# Altium schematic sheet mcu_core.SchDoc
size A4
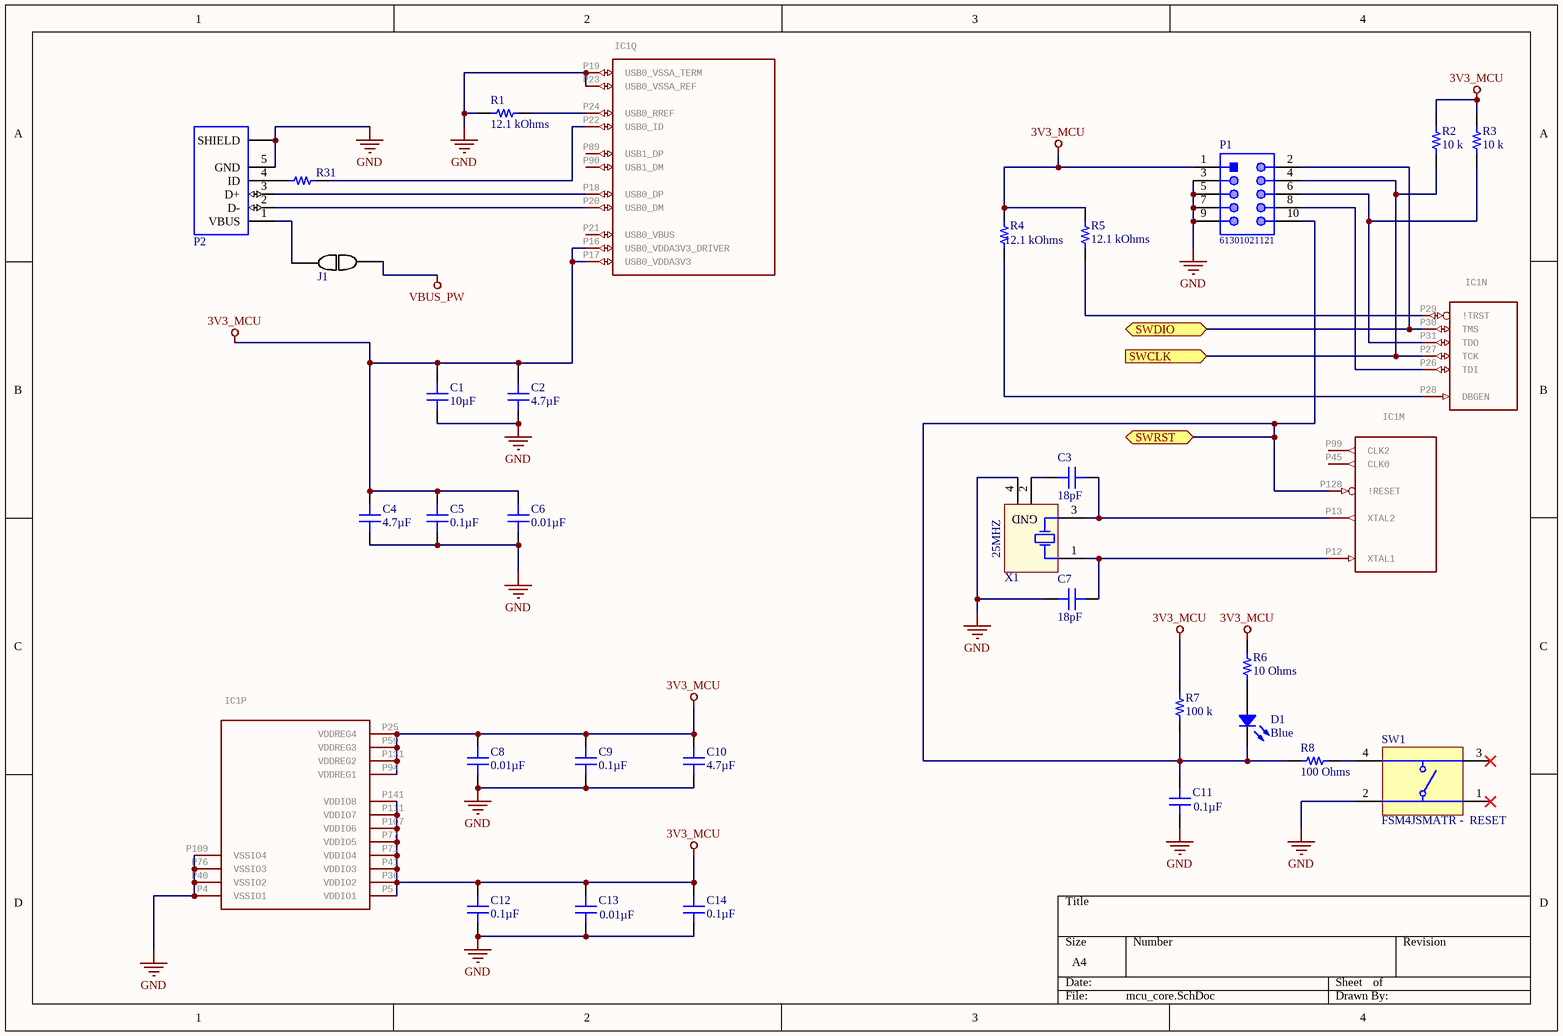
[diagram p0: mcu_core.SchDoc]

## Parts
C1  10µF  [CAP 0603_1608]
C2  4.7µF  [CAP 0603_1608]
C3  18pF  [CAP 0603_1608]
C4  4.7µF  [CAP 0603_1608]
C5  0.1µF  [CAP 0603_1608]
C6  0.01µF  [CAP 0603_1608]
C7  18pF  [CAP 0603_1608]
C8  0.01µF  [CAP 0603_1608]
C9  0.1µF  [CAP 0603_1608]
C10  4.7µF  [CAP 0603_1608]
C11  0.1µF  [CAP 0603_1608]
C12  0.1µF  [CAP 0603_1608]
C13  0.01µF  [CAP 0603_1608]
C14  0.1µF  [CAP 0603_1608]
D1  Blue  [LED 0603_1608 BLUE]
IC1  LQFP144 - SOT486-1    LQFP144: plastic low profile quad flat package; 144 leads; body 20 x 20 x 1.4 mm    body + leads 22 x 22 mm   Solderland (pads) 0.4 x 1.5 mm on corners (8 x) and 0.28 x 1.5 mm (136 x)  [LQFP144]  (value not drawn)  (parts M,N,P,Q of 17)
J1  103185-2  [TE_103185-2]  (value not drawn)
P1  61301021121  [61301021121]
P2  47346-0001  [MOLEX_47346-0001]  (value not drawn)
R1  12.1 kOhms  [RES 0603_1608]
R2  10 k  [RES 0603_1608]
R3  10 k  [RES 0603_1608]
R4  12.1 kOhms  [RES 0603_1608]
R5  12.1 kOhms  [RES 0603_1608]
R6  10 Ohms  [RES 0603_1608]
R7  100 k  [RES 0603_1608]
R8  100 Ohms  [RES 0603_1608]
R31  (no value)  [RES 0603_1608]
SW1  FSM4JSMATR -  RESET  [TECO-FSM4JSMATR_V]
X1  25MHZ  [ABRA-ABMM2-4_V]

## Ports
SWCLK (in), SWDIO (bidir), SWRST (bidir)

## Nets
3V3_MCU: C1.2 C2.2 C4.2 C5.2 C6.2 C8.2 C9.2 C10.2 C12.2 C13.2 C14.2 IC1.P5(VDDIO1) IC1.P16(USB0_VDDA3V3_DRIVER) IC1.P17(USB0_VDDA3V3) IC1.P25(VDDREG4) IC1.P36(VDDIO2) IC1.P41(VDDIO3) IC1.P59(VDDREG3) IC1.P71(VDDIO4) IC1.P77(VDDIO5) IC1.P94(VDDREG1) IC1.P107(VDDIO6) IC1.P111(VDDIO7) IC1.P131(VDDREG2) IC1.P141(VDDIO8) P1.1 R2.2 R3.2 R4.2 R5.2 R6.2 R7.1
GND: C1.1 C2.1 C4.1 C5.1 C6.1 C7.1 C8.1 C9.1 C10.1 C11.2 C12.1 C13.1 C14.1 IC1.P4(VSSIO1) IC1.P19(USB0_VSSA_TERM) IC1.P23(USB0_VSSA_REF) IC1.P40(VSSIO2) IC1.P76(VSSIO3) IC1.P109(VSSIO4) P1.3 P1.5 P1.7 P1.9 P2.5(GND) P2.SH1(SHIELD) P2.SH2(SHIELD) P2.SH3(SHIELD) P2.SH4(SHIELD) P2.SH5(SHIELD) P2.SH6(SHIELD) R1.2 SW1.2 X1.4(GND)
VBUS_PW: J1.1
SWCLK: IC1.P27(TCK) P1.4 R2.1 ; port SWCLK
SWDIO: IC1.P30(TMS) P1.2 ; port SWDIO
SWRST: C11.1 D1.2 IC1.P128(!RESET) P1.10 R7.2 R8.2 ; port SWRST
NetC3_1: C3.1 X1.2(GND)
NetC3_2: C3.2 IC1.P13(XTAL2) X1.3(X2)
NetC7_2: C7.2 IC1.P12(XTAL1) X1.1(X1)
NetD1_1: D1.1 R6.1
NetIC1_P18: IC1.P18(USB0_DP) P2.3(D+)
NetIC1_P20: IC1.P20(USB0_DM) P2.2(D-)
NetIC1_P22: IC1.P22(USB0_ID) R31.2
NetIC1_P24: IC1.P24(USB0_RREF) R1.1
NetIC1_P26: IC1.P26(TDI) P1.8
NetIC1_P28: IC1.P28(DBGEN) R4.1
NetIC1_P29: IC1.P29(!TRST) R5.1
NetIC1_P31: IC1.P31(TDO) P1.6 R3.1
NetJ1_2: J1.2 P2.1(VBUS)
NetP2_4: P2.4(ID) R31.1
NetR8_1: R8.1 SW1.4

Not connected (* = marked no-connect by the designer): IC1 P21(USB0_VBUS) P45(CLK0) P89(USB1_DP) P90(USB1_DM) P99(CLK2); SW1 1* 3*

## Library data of the parts
C1 = GRM188R61A106MAALD: CAP CER 10UF 10V X5R 0603; Manufacturer: Murata Electronics; Tolerance: ±20%; Part Number: GRM188R61A106MAALD; Value: 10µF; Applications: General Purpose; Capacitance: 10µF; ComponentLink1Description: Datasheet; ComponentLink1URL: https://search.murata.co.jp/Ceramy/image/img/A01X/G101/ENG/GRM188R61A106MAAL-01.pdf; ComponentLink2Description: DigiKey Link; ComponentLink2URL: http://digikey.com/product-detail/en/murata-electronics/GRM188R61A106MAALD/490-12734-1-ND/5797703; Device Package: 0603 (1608 Metric); LastUpdated: 02.09.2020 1:03:35; Lifecycle Status: Active; Minimum Order: 1; Mounting Type: Surface Mount, MLCC; Operating Temperature: -55°C ~ 85°C; Package / Case: 0603 (1608 Metric); Packaging: TapeAndReel; PartId: 2423; Part Status: Active; Price: 0.08; Series: GRM; Size / Dimension: 0.063" L x 0.031" W (1.60mm x 0.80mm); Supplier 1: DigiKey; Supplier Part Number 1: 490-12734-1-ND; Temperature Coefficient: X5R; Thickness (Max): 0.037" (0.95mm); Voltage - Rated: 10V
C2 C4 C10 = LMK107BJ475KA-T: CAP CER 4.7UF 10V X5R 0603; Manufacturer: Taiyo Yuden; Tolerance: ±10%; Part Number: LMK107BJ475KA-T; Value: 4.7µF; Applications: General Purpose; Capacitance: 4.7µF; ComponentLink1Description: Datasheet; ComponentLink1URL: https://ds.yuden.co.jp/TYCOMPAS/ut/detail?pn=LMK107BJ475KA-T  &u=M; ComponentLink2Description: DigiKey Link; ComponentLink2URL: http://digikey.com/product-detail/en/taiyo-yuden/LMK107BJ475KA-T/587-1441-1-ND/1004072; Device Package: 0603 (1608 Metric); LastUpdated: 02.09.2020 1:03:36; Lifecycle Status: Active; Minimum Order: 1; Mounting Type: Surface Mount, MLCC; Operating Temperature: -55°C ~ 85°C; Package / Case: 0603 (1608 Metric); Packaging: TapeAndReel; PartId: 2244; Part Status: Active; Price: 0.03; Series: M; Size / Dimension: 0.063" L x 0.031" W (1.60mm x 0.80mm); Supplier 1: DigiKey; Supplier Part Number 1: 587-1441-1-ND; Temperature Coefficient: X5R; Thickness (Max): 0.035" (0.90mm); Voltage - Rated: 10V
C3 C7 = VJ0603A180FXQCW1BC: CAP CER 18PF 10V C0G/NP0 0603; Manufacturer: Vishay Vitramon; Temperature Coefficient: C0G, NP0; Tolerance: ±1%; Part Number: VJ0603A180FXQCW1BC; Value: 18pF; Applications: General Purpose; Capacitance: 18pF; ComponentLink1Description: Datasheet; ComponentLink1URL: https://www.vishay.com/docs/28548/vjw1bcbascomseries.pdf; ComponentLink2Description: DigiKey Link; ComponentLink2URL: http://digikey.com/product-detail/en/vishay-vitramon/VJ0603A180FXQCW1BC/720-1660-1-ND/8324080; Device Package: 0603 (1608 Metric); LastUpdated: 02.09.2020 1:03:27; Lifecycle Status: Active; Minimum Order: 1; Mounting Type: Surface Mount, MLCC; Operating Temperature: -55°C ~ 125°C; Package / Case: 0603 (1608 Metric); Packaging: TapeAndReel; PartId: 7094; Part Status: Active; Price: 0.04; Series: VJ; Size / Dimension: 0.063" L x 0.031" W (1.60mm x 0.80mm); Supplier 1: DigiKey; Supplier Part Number 1: 720-1660-1-ND; Thickness (Max): 0.034" (0.87mm); Voltage - Rated: 10V
C5 C9 C12 C14 = C0603C104K5RAC7411: CAP CER 0.1UF 50V X7R 0603; Manufacturer: KEMET; Tolerance: ±10%; Part Number: C0603C104K5RAC7411; Value: 0.1µF; Applications: Bypass, Decoupling; Capacitance: 0.1µF; ComponentLink1Description: Datasheet; ComponentLink1URL: https://api.kemet.com/component-edge/download/datasheet/C0603C104K5RAC7411.pdf; ComponentLink2Description: DigiKey Link; ComponentLink2URL: http://digikey.com/product-detail/en/kemet/C0603C104K5RAC7411/399-7374-2-ND/3317013; Device Package: 0603 (1608 Metric); LastUpdated: 02.09.2020 1:03:36; Lifecycle Status: Active; Minimum Order: 15000; Mounting Type: Surface Mount, MLCC; Operating Temperature: -55°C ~ 125°C; Package / Case: 0603 (1608 Metric); Packaging: TapeAndReel; PartId: 2233; Part Status: Active; Price: 0.02; Series: SMD Comm X7R; Size / Dimension: 0.063" L x 0.031" W (1.60mm x 0.80mm); Supplier 1: DigiKey; Supplier Part Number 1: 399-7374-2-ND; Temperature Coefficient: X7R; Thickness (Max): 0.035" (0.90mm); Voltage - Rated: 50V
C6 C8 C13 = C0603C103KARACAUTO: CAP CER 0.01UF 250V X7R 0603; Manufacturer: KEMET; Tolerance: ±10%; Part Number: C0603C103KARACAUTO; Value: 0.01µF; Applications: Automotive, Bypass, Decoupling; Capacitance: 0.01µF; ComponentLink1Description: Datasheet; ComponentLink1URL: https://api.kemet.com/component-edge/download/datasheet/C0603C103KARACAUTO.pdf; ComponentLink2Description: DigiKey Link; ComponentLink2URL: http://digikey.com/product-detail/en/kemet/C0603C103KARACAUTO/399-17960-1-ND/9084030; Device Package: 0603 (1608 Metric); LastUpdated: 02.09.2020 1:03:10; Lifecycle Status: Active; Minimum Order: 1; Mounting Type: Surface Mount, MLCC; Operating Temperature: -55°C ~ 125°C; Package / Case: 0603 (1608 Metric); Packaging: TapeAndReel; PartId: 15195; Part Status: Active; Price: 0.25; Ratings: AEC-Q200; Series: SMD Auto X7R; Size / Dimension: 0.063" L x 0.031" W (1.60mm x 0.80mm); Supplier 1: DigiKey; Supplier Part Number 1: 399-17960-1-ND; Temperature Coefficient: X7R; Thickness (Max): 0.034" (0.87mm); Voltage - Rated: 250V
C11 = C0603T104K8RAC7867: CAP CER 0.1UF 10V X7R 0603; Manufacturer: KEMET; Ratings: COTS; Tolerance: ±10%; Part Number: C0603T104K8RAC7867; Value: 0.1µF; Applications: High Reliability, Bypass, Decoupling; Capacitance: 0.1µF; ComponentLink1Description: Datasheet; ComponentLink1URL: https://api.kemet.com/component-edge/download/datasheet/C0603T104K8RAC7867.pdf; ComponentLink2Description: DigiKey Link; ComponentLink2URL: http://digikey.com/product-detail/en/kemet/C0603T104K8RAC7867/399-20424-1-ND/9925028; Device Package: 0603 (1608 Metric); LastUpdated: 02.09.2020 1:03:35; Lifecycle Status: Active; Minimum Order: 1; Mounting Type: Surface Mount, MLCC; Operating Temperature: -55°C ~ 125°C; Package / Case: 0603 (1608 Metric); Packaging: TapeAndReel; PartId: 2528; Part Status: Active; Price: 0.23; Series: SMD COTS X7R; Size / Dimension: 0.063" L x 0.031" W (1.60mm x 0.80mm); Supplier 1: DigiKey; Supplier Part Number 1: 399-20424-1-ND; Temperature Coefficient: X7R; Thickness (Max): 0.034" (0.87mm); Voltage - Rated: 10V
D1 = VLMB1300-GS08: LED BLUE 0603 SMD; Manufacturer: Vishay Semiconductor Opto Division; Configuration: Standard; Current - Test: 20mA; Lens Color: 1.00mm; Lens Size: 1.10mm x 0.80mm; Lens Style: Rectangle with Flat Top; Millicandela Rating: 104mcd; Viewing Angle: 130°; Voltage - Forward (Vf) (Typ): 3.3V; Wavelength - Dominant: 470nm; Wavelength - Peak: 468nm; Part Number: VLMB1300-GS08; Color: Blue; ComponentLink1Description: Datasheet; ComponentLink1URL: http://www.vishay.com/docs/82437/vlmo1300.pdf; ComponentLink2Description: DigiKey Link; ComponentLink2URL: http://digikey.com/product-detail/en/vishay-semiconductor-opto-division/VLMB1300-GS08/VLMB1300-GS08CT-ND/3025485; Device Package: 0603 (1608 Metric); Height (Max): 1.00mm; LastUpdated: 02.09.2020 1:20:26; Lifecycle Status: Active; Minimum Order: 1; Mounting Type: Surface Mount; Package / Case: 0603 (1608 Metric); Packaging: TapeAndReel; PartId: 785; Part Status: Active; Price: 0.08; Series: CHIPLED; Size / Dimension: 1.60mm L x 0.80mm W; Supplier 1: DigiKey; Supplier Part Number 1: VLMB1300-GS08CT-ND; Supplier Device Package: 0603; Value: Blue
IC1 = LPC4300_LQFP144: GateName_1: G$1; SymbolName_1: 144_0_PORT0; GateName_2: G$2; SymbolName_2: 144_1_PORT1; GateName_3: G$3; SymbolName_3: 144_2_PORT2; GateName_4: G$4; SymbolName_4: 144_3_PORT3; GateName_5: G$5; SymbolName_5: 144_4_PORT4; GateName_6: G$6; SymbolName_6: 144_5_PORT5; GateName_7: G$7; SymbolName_7: 144_6_PORT6; GateName_8: G$8; SymbolName_8: 144_7_PORT7; GateName_9: G$9; SymbolName_9: 144_9_PORT9; GateName_10: G$10; SymbolName_10: 144_15_PORTF; GateName_11: G$11; SymbolName_11: 144_16_ANA; GateName_12: G$12; SymbolName_12: 144_17_RTC; GateName_13: G$13; SymbolName_13: 144_18_CLK; GateName_14: G$14; SymbolName_14: 144_19_DBUG; GateName_15: G$15; SymbolName_15: 144_20_I2C; GateName_16: G$16; SymbolName_16: 144_21_SUP; GateName_17: G$17; SymbolName_17: 144_22_USB; LibraryName: LPC4300; DeviceSetName: LPC4300_LQFP144; Package: LQFP144
J1 = 103185-2: 02 MODII HDR SRST B/A .100CL; Package: None; Price: None; Value: *; MP: 103185-2; Availability: Unavailable
P1 = CMP-1502-01084-1: THT Vertical Pin Header WR-PHD, Pitch 2.54 mm, Dual Row, 10 pins; Manufacturer: Wurth Elektronik; Working Voltage: 250VAC; Pitch: 2.54mm; Contact Resistance: 20mOhm; Gender: Male; Rated Current: 3A; Withstanding Voltage: 500VAC; Pin Number: 10; Operating Temperature: -40to105degC; Mounting Technology: THT; Publisher: WurthElektronik; Manufacturer URL: http://www.we-online.de; Part Number: 61301021121; Row Number: Dual; Packaging: Bag; Orientation: Vertical; Package Reference: 61301021121; Datasheet URL: https://katalog.we-online.de/em/datasheet/6130xx21121.pdf
P2 = 47346-0001: CONN RCPT 5POS MICRO USB R/A  SMD; Value: *; Supplier 1: Farnell; Supplier Part Number 1: 1568026; Supplier 2: Mouser; Supplier Part Number 2: 538-47346-0001
R1 R4 R5 = CR0603-FX-1212ELF: RES SMD 12.1K OHM 1% 1/10W 0603; Manufacturer: Bourns Inc.; Power (Watts): 0.1W, 1/10W; Temperature Coefficient: ±100ppm/°C; Part Number: CR0603-FX-1212ELF; Value: 12.1 kOhms; ComponentLink1Description: Datasheet; ComponentLink1URL: https://www.bourns.com/docs/Product-Datasheets/CHPREZTR.pdf; ComponentLink2Description: DigiKey Link; ComponentLink2URL: http://digikey.com/product-detail/en/bourns-inc/CR0603-FX-1212ELF/CR0603-FX-1212ELFCT-ND/3925302; Composition: Thick Film; Device Package: 0603 (1608 Metric); Features: Moisture Resistant; Height - Seated (Max): 0.022" (0.55mm); LastUpdated: 02.09.2020 1:10:21; Lifecycle Status: Active; Minimum Order: 1; Number of Terminations: 2; Operating Temperature: -55°C ~ 155°C; Package / Case: 0603 (1608 Metric); Packaging: CutTape; PartId: 6585; Part Status: Active; Price: 0.10; Resistance: 12.1 kOhms; Series: CR0603; Size / Dimension: 0.063" L x 0.031" W (1.60mm x 0.80mm); Supplier 1: DigiKey; Supplier Part Number 1: CR0603-FX-1212ELFCT-ND; Supplier Device Package: 0603; Tolerance: ±1%
R2 R3 = RNCS0603BKE10K0: RES 10K OHM 0.1% 1/16W 0603; Manufacturer: Stackpole Electronics Inc; Power (Watts): 0.063W, 1/16W; Resistance: 10 kOhms; Temperature Coefficient: ±25ppm/°C; Part Number: RNCS0603BKE10K0; Value: 10 k; ComponentLink1Description: Datasheet; ComponentLink1URL: https://www.seielect.com/catalog/sei-rncs_rnch.pdf; ComponentLink2Description: DigiKey Link; ComponentLink2URL: http://digikey.com/product-detail/en/stackpole-electronics-inc/RNCS0603BKE10K0/RNCS0603BKE10K0CT-ND/1800113; Composition: Thin Film; Device Package: 0603 (1608 Metric); Features: Anti-Corrosive, Automotive AEC-Q200, Moisture Resistant; Height - Seated (Max): 0.022" (0.55mm); LastUpdated: 02.09.2020 1:10:25; Lifecycle Status: Active; Minimum Order: 1; Number of Terminations: 2; Operating Temperature: -55°C ~ 155°C; Package / Case: 0603 (1608 Metric); Packaging: TapeAndReel; PartId: 4838; Part Status: Active; Price: 0.08; Ratings: AEC-Q200; Series: RNCS; Size / Dimension: 0.061" L x 0.031" W (1.55mm x 0.80mm); Supplier 1: DigiKey; Supplier Part Number 1: RNCS0603BKE10K0CT-ND; Supplier Device Package: 0603; Tolerance: ±0.1%
R6 = CRT0603-BY-10R0ELF: RES SMD 10 OHM 0.1% 1/10W 0603; Manufacturer: Bourns Inc.; Power (Watts): 0.1W, 1/10W; Temperature Coefficient: ±25ppm/°C; Part Number: CRT0603-BY-10R0ELF; Value: 10 Ohms; ComponentLink1Description: Datasheet; ComponentLink1URL: https://www.bourns.com/docs/Product-Datasheets/crt.pdf; ComponentLink2Description: DigiKey Link; ComponentLink2URL: http://digikey.com/product-detail/en/bourns-inc/CRT0603-BY-10R0ELF/CRT0603-BY-10R0ELFCT-ND/1775043; Composition: Thin Film; Device Package: 0603 (1608 Metric); Features: Current Sense; Height - Seated (Max): 0.024" (0.60mm); LastUpdated: 02.09.2020 1:10:25; Lifecycle Status: Active; Minimum Order: 1; Number of Terminations: 2; Operating Temperature: -55°C ~ 155°C; Package / Case: 0603 (1608 Metric); Packaging: TapeAndReel; PartId: 4866; Part Status: Active; Price: 0.05; Resistance: 10 Ohms; Series: CRT; Size / Dimension: 0.061" L x 0.031" W (1.55mm x 0.80mm); Supplier 1: DigiKey; Supplier Part Number 1: CRT0603-BY-10R0ELFCT-ND; Supplier Device Package: 0603; Tolerance: ±0.1%
R7 = RMCF0603JT100K: RES 100K OHM 5% 1/10W 0603; Manufacturer: Stackpole Electronics Inc; Power (Watts): 0.1W, 1/10W; Resistance: 100 kOhms; Temperature Coefficient: ±200ppm/°C; Part Number: RMCF0603JT100K; Value: 100 k; ComponentLink1Description: Datasheet; ComponentLink1URL: https://www.seielect.com/catalog/sei-rmcf_rmcp.pdf; ComponentLink2Description: DigiKey Link; ComponentLink2URL: http://digikey.com/product-detail/en/stackpole-electronics-inc/RMCF0603JT100K/RMCF0603JT100KCT-ND/1943203; Composition: Thick Film; Device Package: 0603 (1608 Metric); Features: Automotive AEC-Q200; Height - Seated (Max): 0.022" (0.55mm); LastUpdated: 02.09.2020 1:10:23; Lifecycle Status: Active; Minimum Order: 1; Number of Terminations: 2; Operating Temperature: -55°C ~ 155°C; Package / Case: 0603 (1608 Metric); Packaging: CutTape; PartId: 5863; Part Status: Active; Price: 0.10; Ratings: AEC-Q200; Series: RMCF; Size / Dimension: 0.061" L x 0.031" W (1.55mm x 0.80mm); Supplier 1: DigiKey; Supplier Part Number 1: RMCF0603JT100KCT-ND; Supplier Device Package: 0603; Tolerance: ±5%
R8 = RNCS0603BKE100R: RES 100 OHM 0.1% 1/16W 0603; Manufacturer: Stackpole Electronics Inc; Power (Watts): 0.063W, 1/16W; Temperature Coefficient: ±25ppm/°C; Part Number: RNCS0603BKE100R; Value: 100 Ohms; ComponentLink1Description: Datasheet; ComponentLink1URL: https://www.seielect.com/catalog/sei-rncs_rnch.pdf; ComponentLink2Description: DigiKey Link; ComponentLink2URL: http://digikey.com/product-detail/en/stackpole-electronics-inc/RNCS0603BKE100R/RNCS0603BKE100RCT-ND/1800117; Composition: Thin Film; Device Package: 0603 (1608 Metric); Features: Anti-Corrosive, Automotive AEC-Q200, Moisture Resistant; Height - Seated (Max): 0.022" (0.55mm); LastUpdated: 02.09.2020 1:10:25; Lifecycle Status: Active; Minimum Order: 1; Number of Terminations: 2; Operating Temperature: -55°C ~ 155°C; Package / Case: 0603 (1608 Metric); Packaging: TapeAndReel; PartId: 4839; Part Status: Active; Price: 0.08; Ratings: AEC-Q200; Resistance: 100 Ohms; Series: RNCS; Size / Dimension: 0.061" L x 0.031" W (1.55mm x 0.80mm); Supplier 1: DigiKey; Supplier Part Number 1: RNCS0603BKE100RCT-ND; Supplier Device Package: 0603; Tolerance: ±0.1%
R31 = TLRZ1JTTD: RES 0 OHM JUMPER 0603; Manufacturer: KOA Speer Electronics, Inc.; Part Number: TLRZ1JTTD; ComponentLink1Description: Datasheet; ComponentLink1URL: http://www.koaspeer.com/catimages/Products/TLRZ/TLRZ.pdf; ComponentLink2Description: DigiKey Link; ComponentLink2URL: http://digikey.com/product-detail/en/koa-speer-electronics-inc/TLRZ1JTTD/2019-TLRZ1JTTDCT-ND/9847537; Composition: Metal Element; Device Package: 0603 (1608 Metric); Features: Automotive AEC-Q200, Current Sense; Height - Seated (Max): 0.022" (0.55mm); LastUpdated: 02.09.2020 1:10:25; Lifecycle Status: Active; Minimum Order: 1; Number of Terminations: 2; Operating Temperature: -55°C ~ 170°C; Package / Case: 0603 (1608 Metric); Packaging: TapeAndReel; PartId: 4851; Part Status: Active; Price: 0.08; Ratings: AEC-Q200; Series: TLRZ; Size / Dimension: 0.063" L x 0.031" W (1.60mm x 0.80mm); Supplier 1: DigiKey; Supplier Part Number 1: 2019-TLRZ1JTTDCT-ND; Supplier Device Package: 0603; Tolerance: Jumper
SW1 = CMP-2000-07486-1: Micro Miniature Push Button Switch FSM JSM, 50 mA, -35 to 85 degC, 4-Pin SMD, RoHS, Tape and Reel; Manufacturer: TE Connectivity; Mechanical Life: 100000Cycles; Current Rating: 50mA; Actuator Material: Polyamide; Max Voltage Rating (DC): 12V; Capacitance: 0f; Illumination Type: Illuminated; Voltage Rating (DC): 24V; Case\/Package: SMD/SMT; Operating Force: 160gf; Contact Resistance: 100mOhm; Actuator Length: 0.055inch; Switch Travel: 0.25mm; Throw Configuration: SPST; Termination: GullWing; Contact Plating: Silver; Orientation: Straight; Mounting Technology: SurfaceMount; REACH SVHC: Unknown; Electrical Life: 100000Cycles; Package Reference: FSM4JSMATR; Max Operating Temperature: 85degC; Manufacturer URL: http://www.te.com/; Package Description: 4-Pin Surface Mount Device, Body 6 x 6 mm, Pitch 4.5 mm; Datasheet Version: Rev. V, 02/2015; Packaging: TapeandReel; Min Operating Temperature: -35degC; Mount: SurfaceMount; Contact Current Rating: 50mA; Contact Material: CopperAlloy; Package Quantity: 1200; Datasheet URL: http://www.te.com/commerce/DocumentDelivery/DDEController?Action=showdoc&DocId=Customer+Drawing%7F2-1437565-7%7FV%7Fpdf%7FEnglish%7FENG_CD_2-1437565-7_V.pdf%7F4-1437565-2; RoHSCompliant: true
X1 = CMP-0277-00003-1: Ceramic Surface Mount Low Profile Quartz Crystal, 8 MHz, -20 to 70 degC, 4-Pin 6 x 3.6 x 1.2 mm SMD, RoHS, 1000pcs / Reel; Manufacturer: Abracon; PartNumber: ABMM2-8.000MHZ-E2-T; ESR: 72 Ohm Max.; Frequency: 8 MHz; Shunt Capacitance C0: 7 pF Max.; Load Capacitance CL: 18 pF Typ.; ComponentLink3Description: Package Specification; PackageDescription: 4-Pin SMD, Body 6 x 3.6 mm, Pitch 4.4 mm; DatasheetVersion: Jan-13; ComponentLink1URL: http://www.abracon.com/; ComponentLink2URL: http://www.abracon.com/Resonators/ABMM2.pdf; Temperature Range: -20 to 70 degC; Mounting Technology: Surface Mount; RoHS: TRUE; ComponentLink2Description: Datasheet; ComponentLink3URL: http://www.abracon.com/Resonators/ABMM2.pdf; ComponentLink1Description: Manufacturer URL; Packing: 1000pcs / Reel